# Altium schematic sheet Sheet1.SchDoc
size A4
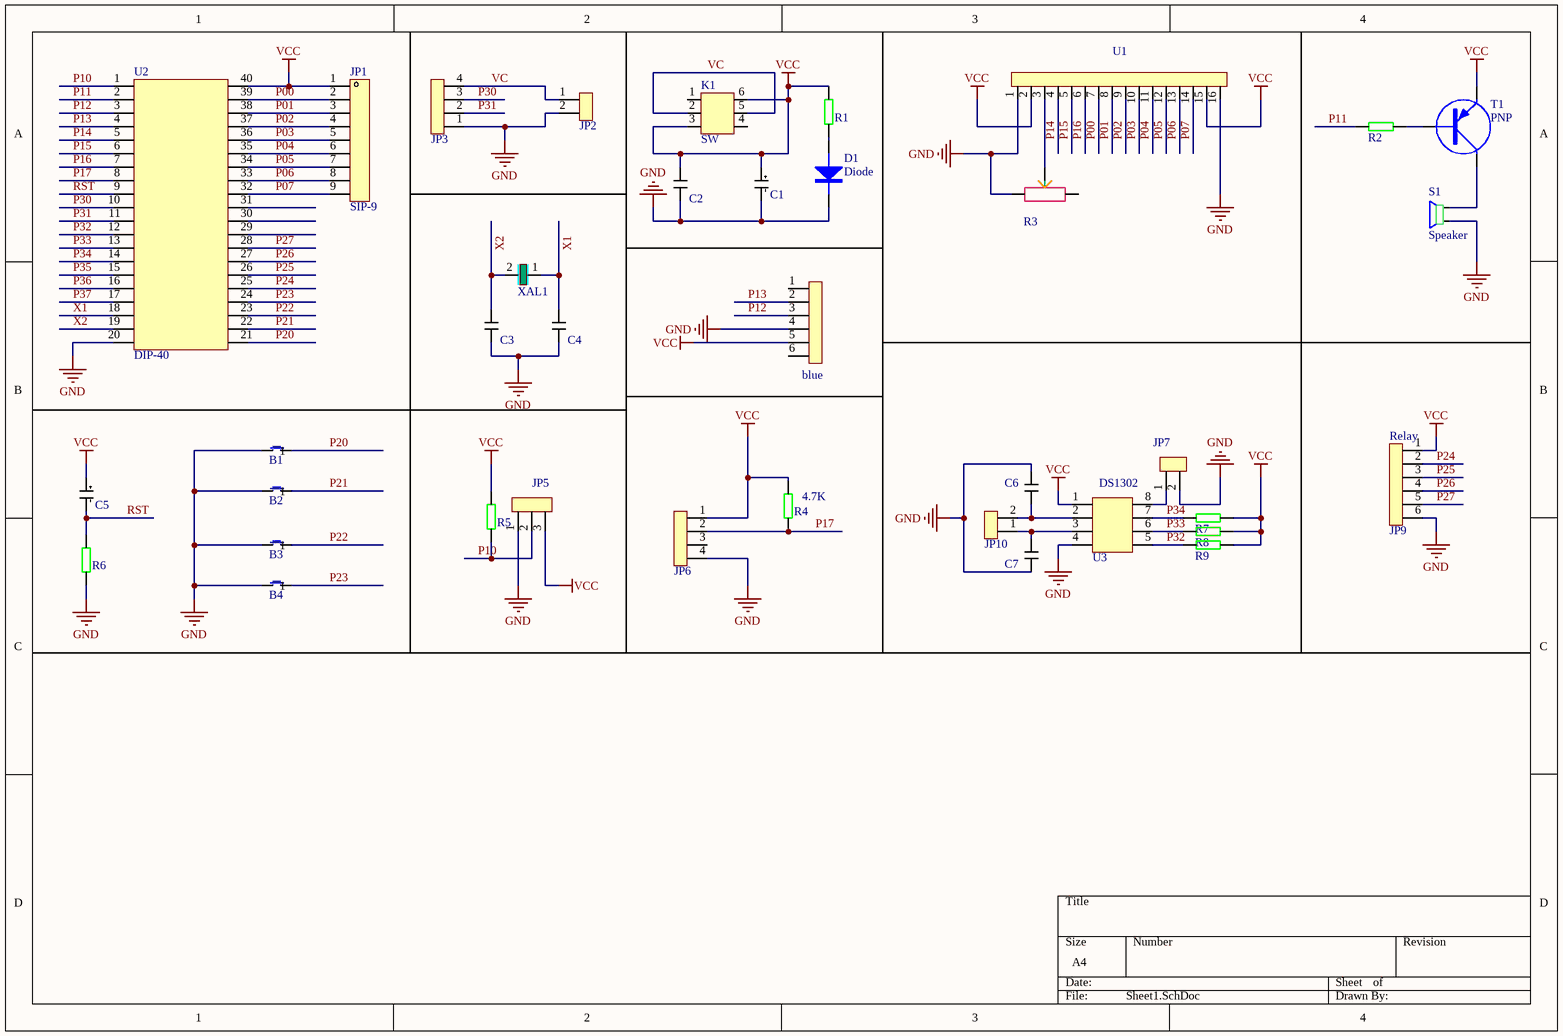
[diagram p0: Sheet1.SchDoc]

## Parts
B1  Button  [Button]  (value not drawn)
B2  Button  [Button]  (value not drawn)
B3  Button  [Button]  (value not drawn)
B4  Button  [Button]  (value not drawn)
C1  CAP+  [CAP-100mil]  (value not drawn)
C2  CAP  [CAP-100mil]  (value not drawn)
C3  CAP  [0805]  (value not drawn)
C4  CAP  [0805]  (value not drawn)
C5  CAP+  [CAP-100mil]  (value not drawn)
C6  CAP  [0805]  (value not drawn)
C7  CAP  [0805]  (value not drawn)
D1  Diode  [SIP-2]
JP1  SIP-9  [SIP-9]
JP2  SIP-2  [SIP-2]  (value not drawn)
JP3  SIP-4  [SIP-4]  (value not drawn)
JP4  blue  [SIP-6]
JP5  SIP-3  [SIP-3]  (value not drawn)
JP6  SIP-4  [SIP-4]  (value not drawn)
JP7  SIP-2  [SIP-6]  (value not drawn)
JP9  Relay  [SIP-6]
JP10  SIP-2  [SIP-2]  (value not drawn)
K1  SW  [SW]
R1  RES  [0805]  (value not drawn)
R2  RES  [0805]  (value not drawn)
R3  电位器  [电位器]  (value not drawn)
R4  RES  [RES-300mil]  (value not drawn)
R5  RES  [RES-300mil]  (value not drawn)
R6  RES  [RES-300mil]  (value not drawn)
R7  RES  [0805]  (value not drawn)
R8  RES  [0805]  (value not drawn)
R9  RES  [0805]  (value not drawn)
S1  Speaker  [RES-300mil]
T1  PNP  [三极管]
U1  SIP-16  [SIP-16]  (value not drawn)
U2  DIP-40  [DIP-40-600mil]
U3  DS1302  [SOP8]
XAL1  晶振  [晶振-200mil]  (value not drawn)

## Nets
GND: B1.1 B2.1 B3.1 B4.1 C1.2 C2.1 C3.2 C4.2 C6.1 C7.1 D1.2 JP2.2 JP3.1 JP4.4 JP5.1 JP6.4 JP7.2 JP9.6 R3.1 R6.1 S1.1 U1.1 U1.16 U2.20 U3.4
VCC: C1.1 C2.2 C5.1 JP1.1 JP4.5 JP5.3 JP6.1 JP9.1 K1.3 K1.6 R1.2 R4.2 R5.2 R7.2 R8.2 R9.2 T1.E U1.2 U1.15 U2.40 U3.1
P00: JP1.2 U1.7 U2.39
P01: JP1.3 U1.8 U2.38
P02: JP1.4 U1.9 U2.37
P03: JP1.5 U1.10 U2.36
P04: JP1.6 U1.11 U2.35
P05: JP1.7 U1.12 U2.34
P06: JP1.8 U1.13 U2.33
P07: JP1.9 U1.14 U2.32
P10: JP5.2 R5.1 U2.1
P11: R2.1 U2.2
P12: JP4.3 U2.3
P13: JP4.2 U2.4
P14: U1.4 U2.5
P15: U1.5 U2.6
P16: U1.6 U2.7
P17: JP6.2 R4.1 U2.8
P20: B1.3 U2.21
P21: B2.3 U2.22
P22: B3.3 U2.23
P23: B4.3 U2.24
P24: JP9.2 U2.25
P25: JP9.3 U2.26
P26: JP9.4 U2.27
P27: JP9.5 U2.28
P30: JP3.3 U2.10
P31: JP3.2 U2.11
P32: R9.1 U2.12 U3.5
P33: R8.1 U2.13 U3.6
P34: R7.1 U2.14 U3.7
P35: U2.15
P36: U2.16
P37: U2.17
RST: C5.2 R6.2 U2.9
VC: JP2.1 JP3.4 K1.2 K1.5
X1: C4.1 U2.18 XAL1.1
X2: C3.1 U2.19 XAL1.2
NetC6_2: C6.2 JP10.2 U3.2
NetC7_2: C7.2 JP10.1 U3.3
NetD1_1: D1.1 R1.1
NetJP7_1: JP7.1 U3.8
NetR2_2: R2.2 T1.B
NetR3_2: R3.2 U1.3
NetS1_2: S1.2 T1.C

Not connected (* = marked no-connect by the designer): JP4 1 6; JP6 3; K1 1 4; R3 3; U2 29 30 31

## Notes on the sheet
- (in symbol RES) 4.7K

## Library data of the parts
JP4 JP9 = SIP-6
JP7 = SIP-2: pin to pad: 2>6
U3 = DIP-8: pin to pad: 1>8 2>7 3>6 4>5 5>4 6>3 7>2 8>1